# Altium schematic sheet Sheet4.SchDoc: solar-powered-remote-water-level-relay
size 419 x 297 mm; Date: 2026/06/29; Author: forlook88@gmail.com; Revision: 0; SheetNumber: 4; SheetTotal: 11
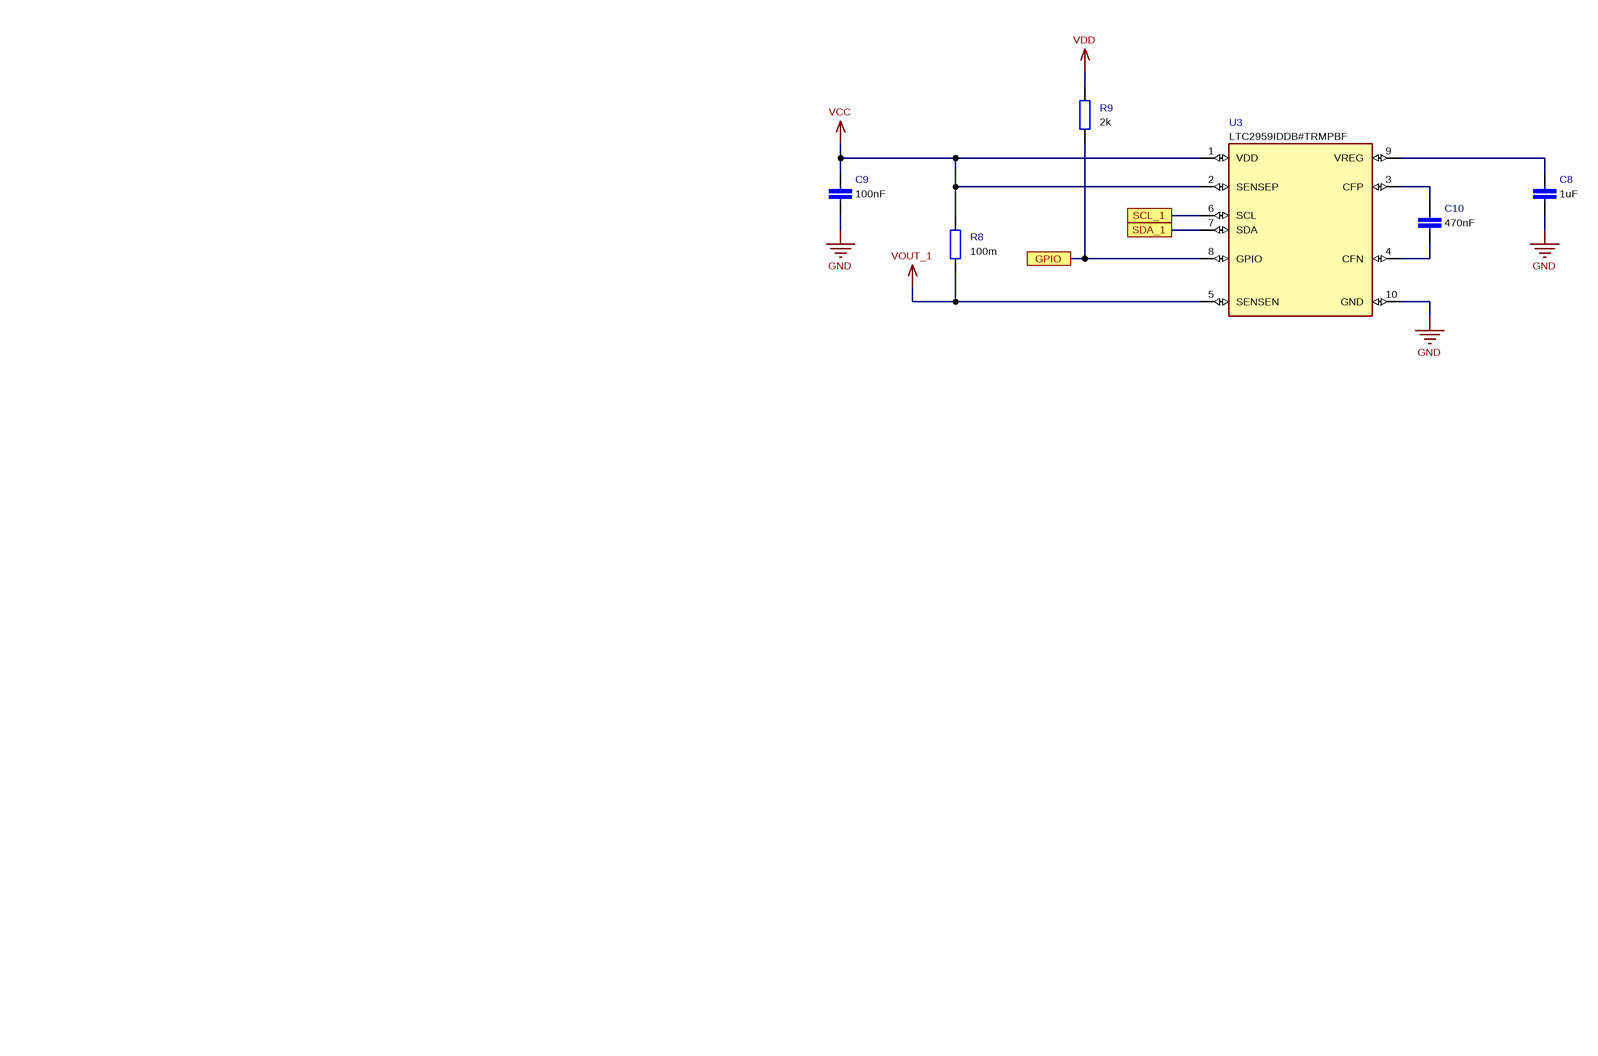
[diagram p0: Sheet4.SchDoc]

## Parts
C8  value 1uF
C9  value 100nF
C10  value 470nF
R8  value 100m
R9  value 2k
U3  value LTC2959IDDB#TRMPBF

## Ports
GPIO, SCL_1, SDA_1

## Nets
GND: C8.2 C9.2 U3.10(GND) U3.11(GND)
VCC: C9.1 R8.2 U3.1(VDD) U3.2(SENSEP)
VDD: R9.2
VOUT_1: R8.1 U3.5(SENSEN)
GPIO: R9.1 U3.8(GPIO) ; port GPIO
SCL_1: U3.6(SCL) ; port SCL_1
SDA_1: U3.7(SDA) ; port SDA_1
NetC8_1: C8.1 U3.9(VREG)
NetC10_1: C10.1 U3.3(CFP)
NetC10_2: C10.2 U3.4(CFN)

## Notes on the sheet
- Document Name:
- Project Name:
- Sheet Name:
- Sheet Number:
- Author:
- CELUS Design Platform electronic designs are machine-generated drafts and require verification by qualified specialists.
- of
- Revision:
- Date:
- By using these designs, you agree to the CELUS Terms of Use: https://www.celus.io/terms-of-use

## Library data of the parts
C8 = (no symbol name): Manufacturer Part Number: 12061C105K4Z4A; Manufacturer: KYOCERA AVX
C9 = (no symbol name): Manufacturer Part Number: 08051C104KAT2A; Manufacturer: KYOCERA AVX
C10 = (no symbol name): Manufacturer Part Number: 08051C474K4Z2A; Manufacturer: KYOCERA AVX
R8 = (no symbol name): Manufacturer Part Number: ERJ-2BSFR10X; Manufacturer: Panasonic
R9 = (no symbol name): Manufacturer Part Number: ERJ-2RKF2001X; Manufacturer: Panasonic
U3 = (no symbol name): Manufacturer: Analog Devices; Manufacturer Part Number: LTC2959IDDB#TRMPBF